# EAGLE schematic Schematic (EAGLE 6.4)
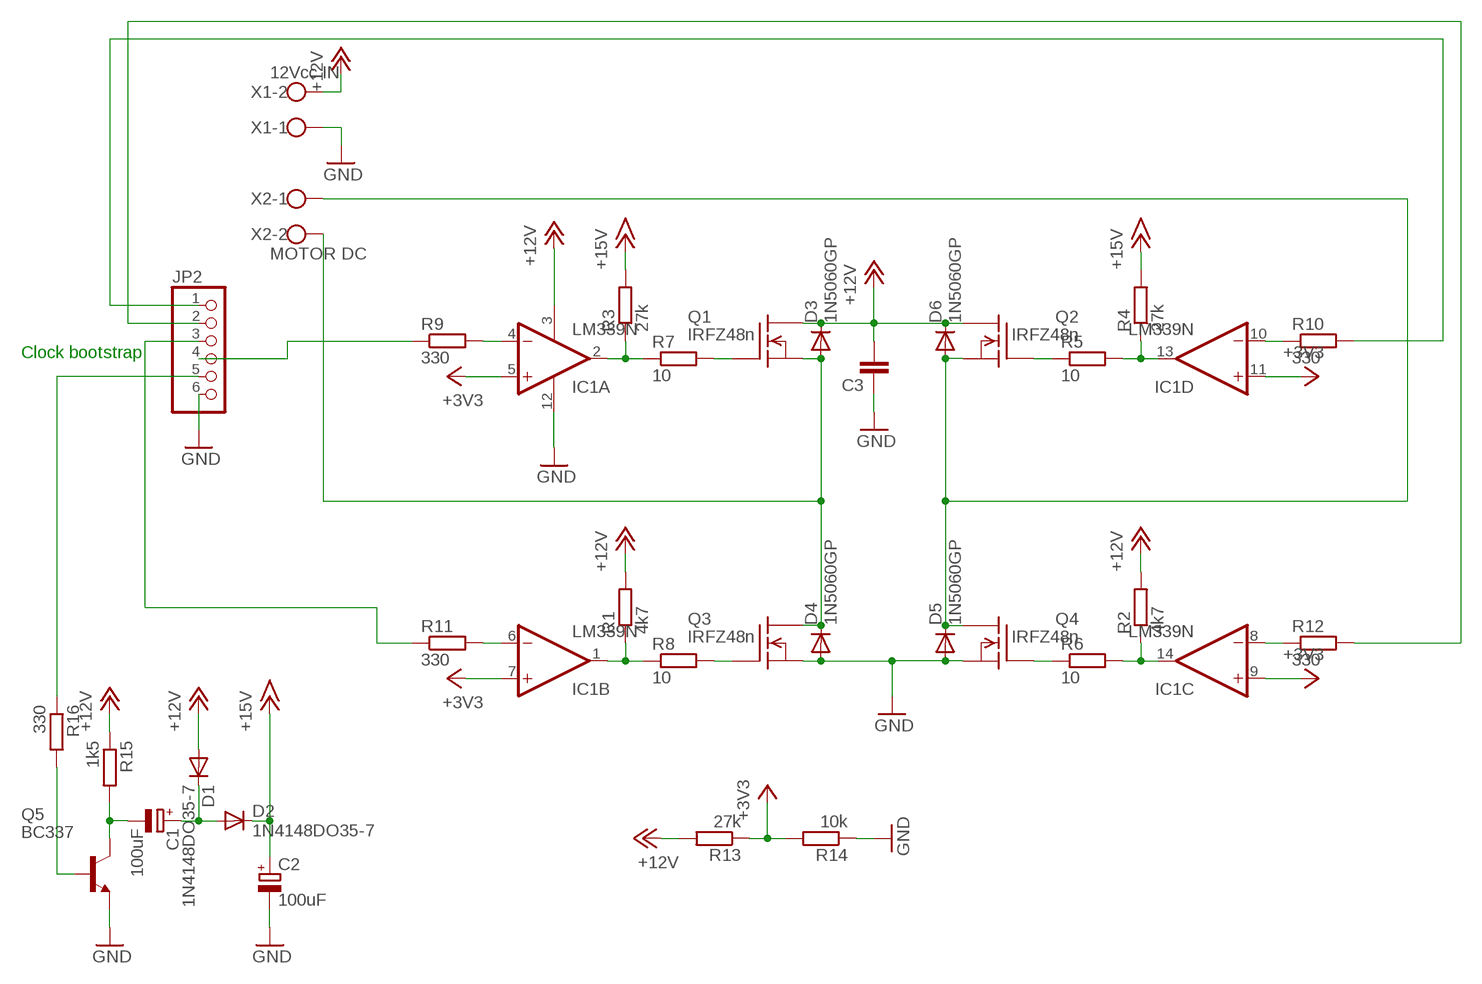
[diagram p0: schematic, sheet 1]

## Parts
C1  100uF  CPOL-EUE3.5-8  [E3,5-8]
C2  100uF  CPOL-EUE3.5-8  [E3,5-8]
C3  C-EU050-024X044  [C050-024X044]
D1  1N4148DO35-7  [DO35-7]
D2  1N4148DO35-7  [DO35-7]
D3  1N5060GP  [DO15-12]
D4  1N5060GP  [DO15-12]
D5  1N5060GP  [DO15-12]
D6  1N5060GP  [DO15-12]
IC1  LM339N  [DIL14]
JP2  PINHD-1X6  [1X06]
Q1  IRFZ48n  IRF510  [TO220]
Q2  IRFZ48n  IRF510  [TO220]
Q3  IRFZ48n  IRF510  [TO220]
Q4  IRFZ48n  IRF510  [TO220]
Q5  BC337  [TO92]
R1  4k7  R-EU_0204/7  [0204/7]
R2  4k7  R-EU_0207/10  [0207/10]
R3  27k  R-EU_0204/7  [0204/7]
R4  27k  R-EU_0207/10  [0207/10]
R5  10  R-EU_0207/7  [0207/7]
R6  10  R-EU_0207/10  [0207/10]
R7  10  R-EU_0207/10  [0207/10]
R8  10  R-EU_0207/7  [0207/7]
R9  330  R-EU_0204/7  [0204/7]
R10  330  R-EU_0207/7  [0207/7]
R11  330  R-EU_0204/7  [0204/7]
R12  330  R-EU_0207/7  [0207/7]
R13  27k  R-EU_0204/7  [0204/7]
R14  10k  R-EU_0204/7  [0204/7]
R15  1k5  R-EU_0204/5  [0204/5]
R16  330  R-EU_0207/7  [0207/7]
X1  12Vcc IN  W237-102  [W237-102]
X2  MOTOR DC  W237-102  [W237-102]

## Nets
+3V3: IC1.5(A:+IN) IC1.7(B:+IN) IC1.9(C:+IN) IC1.11(D:+IN) R13.1 R14.2
+12V: C3.2 D1.A D3.C D6.C IC1.3(P:V+) Q1.2(D) Q2.2(D) R1.2 R2.2 R13.2 R15.1 X1.2
+15V: C2.+ D2.C R3.2 R4.2
GND: C2.- C3.1 D4.A D5.A IC1.12(P:GND) JP2.6 Q3.3(S) Q4.3(S) Q5.1(E) R14.1 X1.1
N$1: IC1.2(A:OUT) R3.1 R7.1
N$2: IC1.13(D:OUT) R4.1 R5.2
N$3: Q1.1(G) R7.2
N$4: Q2.1(G) R5.1
N$5: IC1.14(C:OUT) R2.1 R6.2
N$6: IC1.1(B:OUT) R1.1 R8.1
N$7: IC1.4(A:-IN) R9.2
N$8: IC1.10(D:-IN) R10.1
N$9: Q4.1(G) R6.1
N$10: IC1.8(C:-IN) R12.1
N$11: Q3.1(G) R8.2
N$12: IC1.6(B:-IN) R11.2
N$13: D3.A D4.C Q1.3(S) Q3.2(D) X2.2
N$14: JP2.4 R9.1
N$15: JP2.1 R10.2
N$16: D5.C D6.A Q2.3(S) Q4.2(D) X2.1
N$17: JP2.3 R11.1
N$18: JP2.2 R12.2
N$19: C1.+ D1.C D2.A
N$20: Q5.2(B) R16.2
N$21: JP2.5 R16.1
N$22: C1.- Q5.3(C) R15.2

## Notes on the sheet
- Clock bootstrap

## Library data of the parts
C1 C2 = rcl:CPOL-EU: POLARIZED CAPACITOR, European symbol
C3 = rcl:C-EU: CAPACITOR, European symbol
D1 D2 = diode:1N4148: DIODE high speed (Philips)
D3-D6 = diode:1N5060GP: DIODE controlled avalanche rectifier
IC1 = linear:LM339: Low Power Low Offset Voltage Quad Comparators with open collector; LM139/LM239/LM339/LM2901/LM3302
JP2 = pinhead:PINHD-1X6: PIN HEADER
Q1-Q4 = transistor-fet:IRF510: N-Channel Enhancement MOSFET (HEXFET); 100V; 5,6A; 0,54Ohm
Q5 = transistor-npn:BC337*: NPN Transistor
R1-R16 = rcl:R-EU_: RESISTOR, European symbol
X1 X2 = con-wago-500:W237-102: WAGO SCREW CLAMP; MPN: 237-102; OC_FARNELL: unknown; OC_NEWARK: 70K9898